# EAGLE schematic DuetReference (EAGLE 9.2.0)
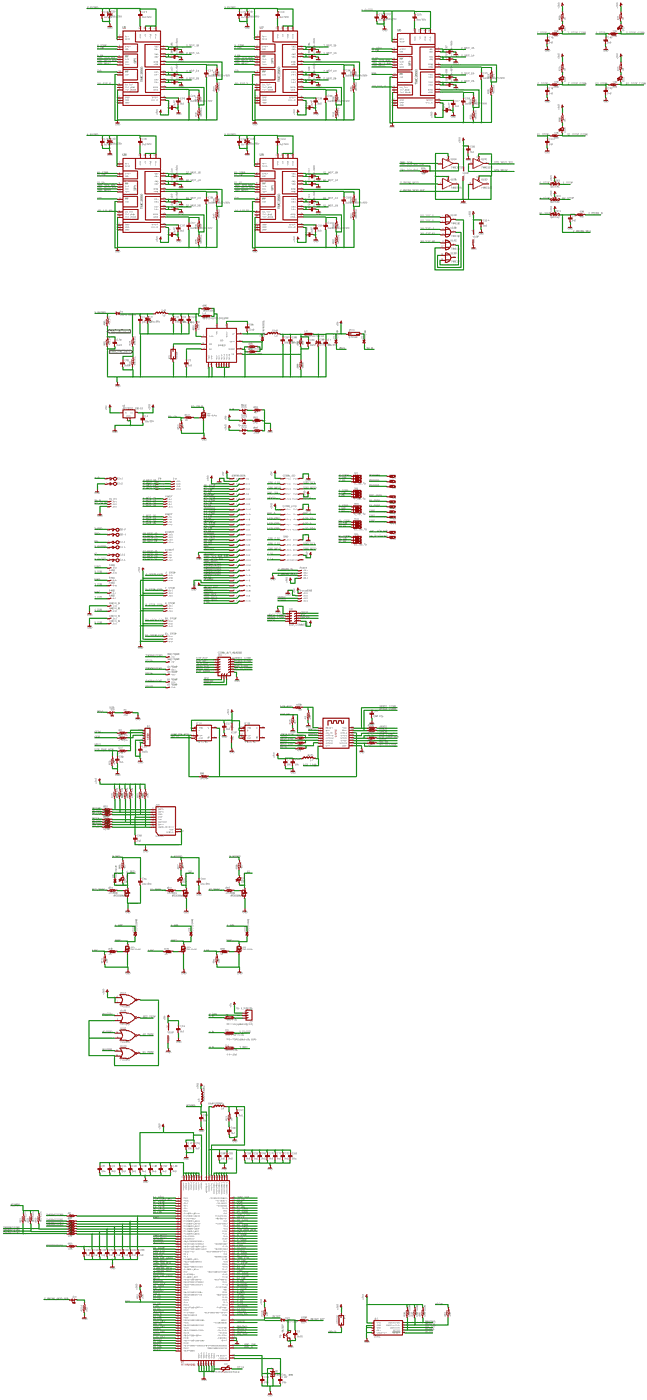
[diagram p0: schematic, sheet 1, overview]
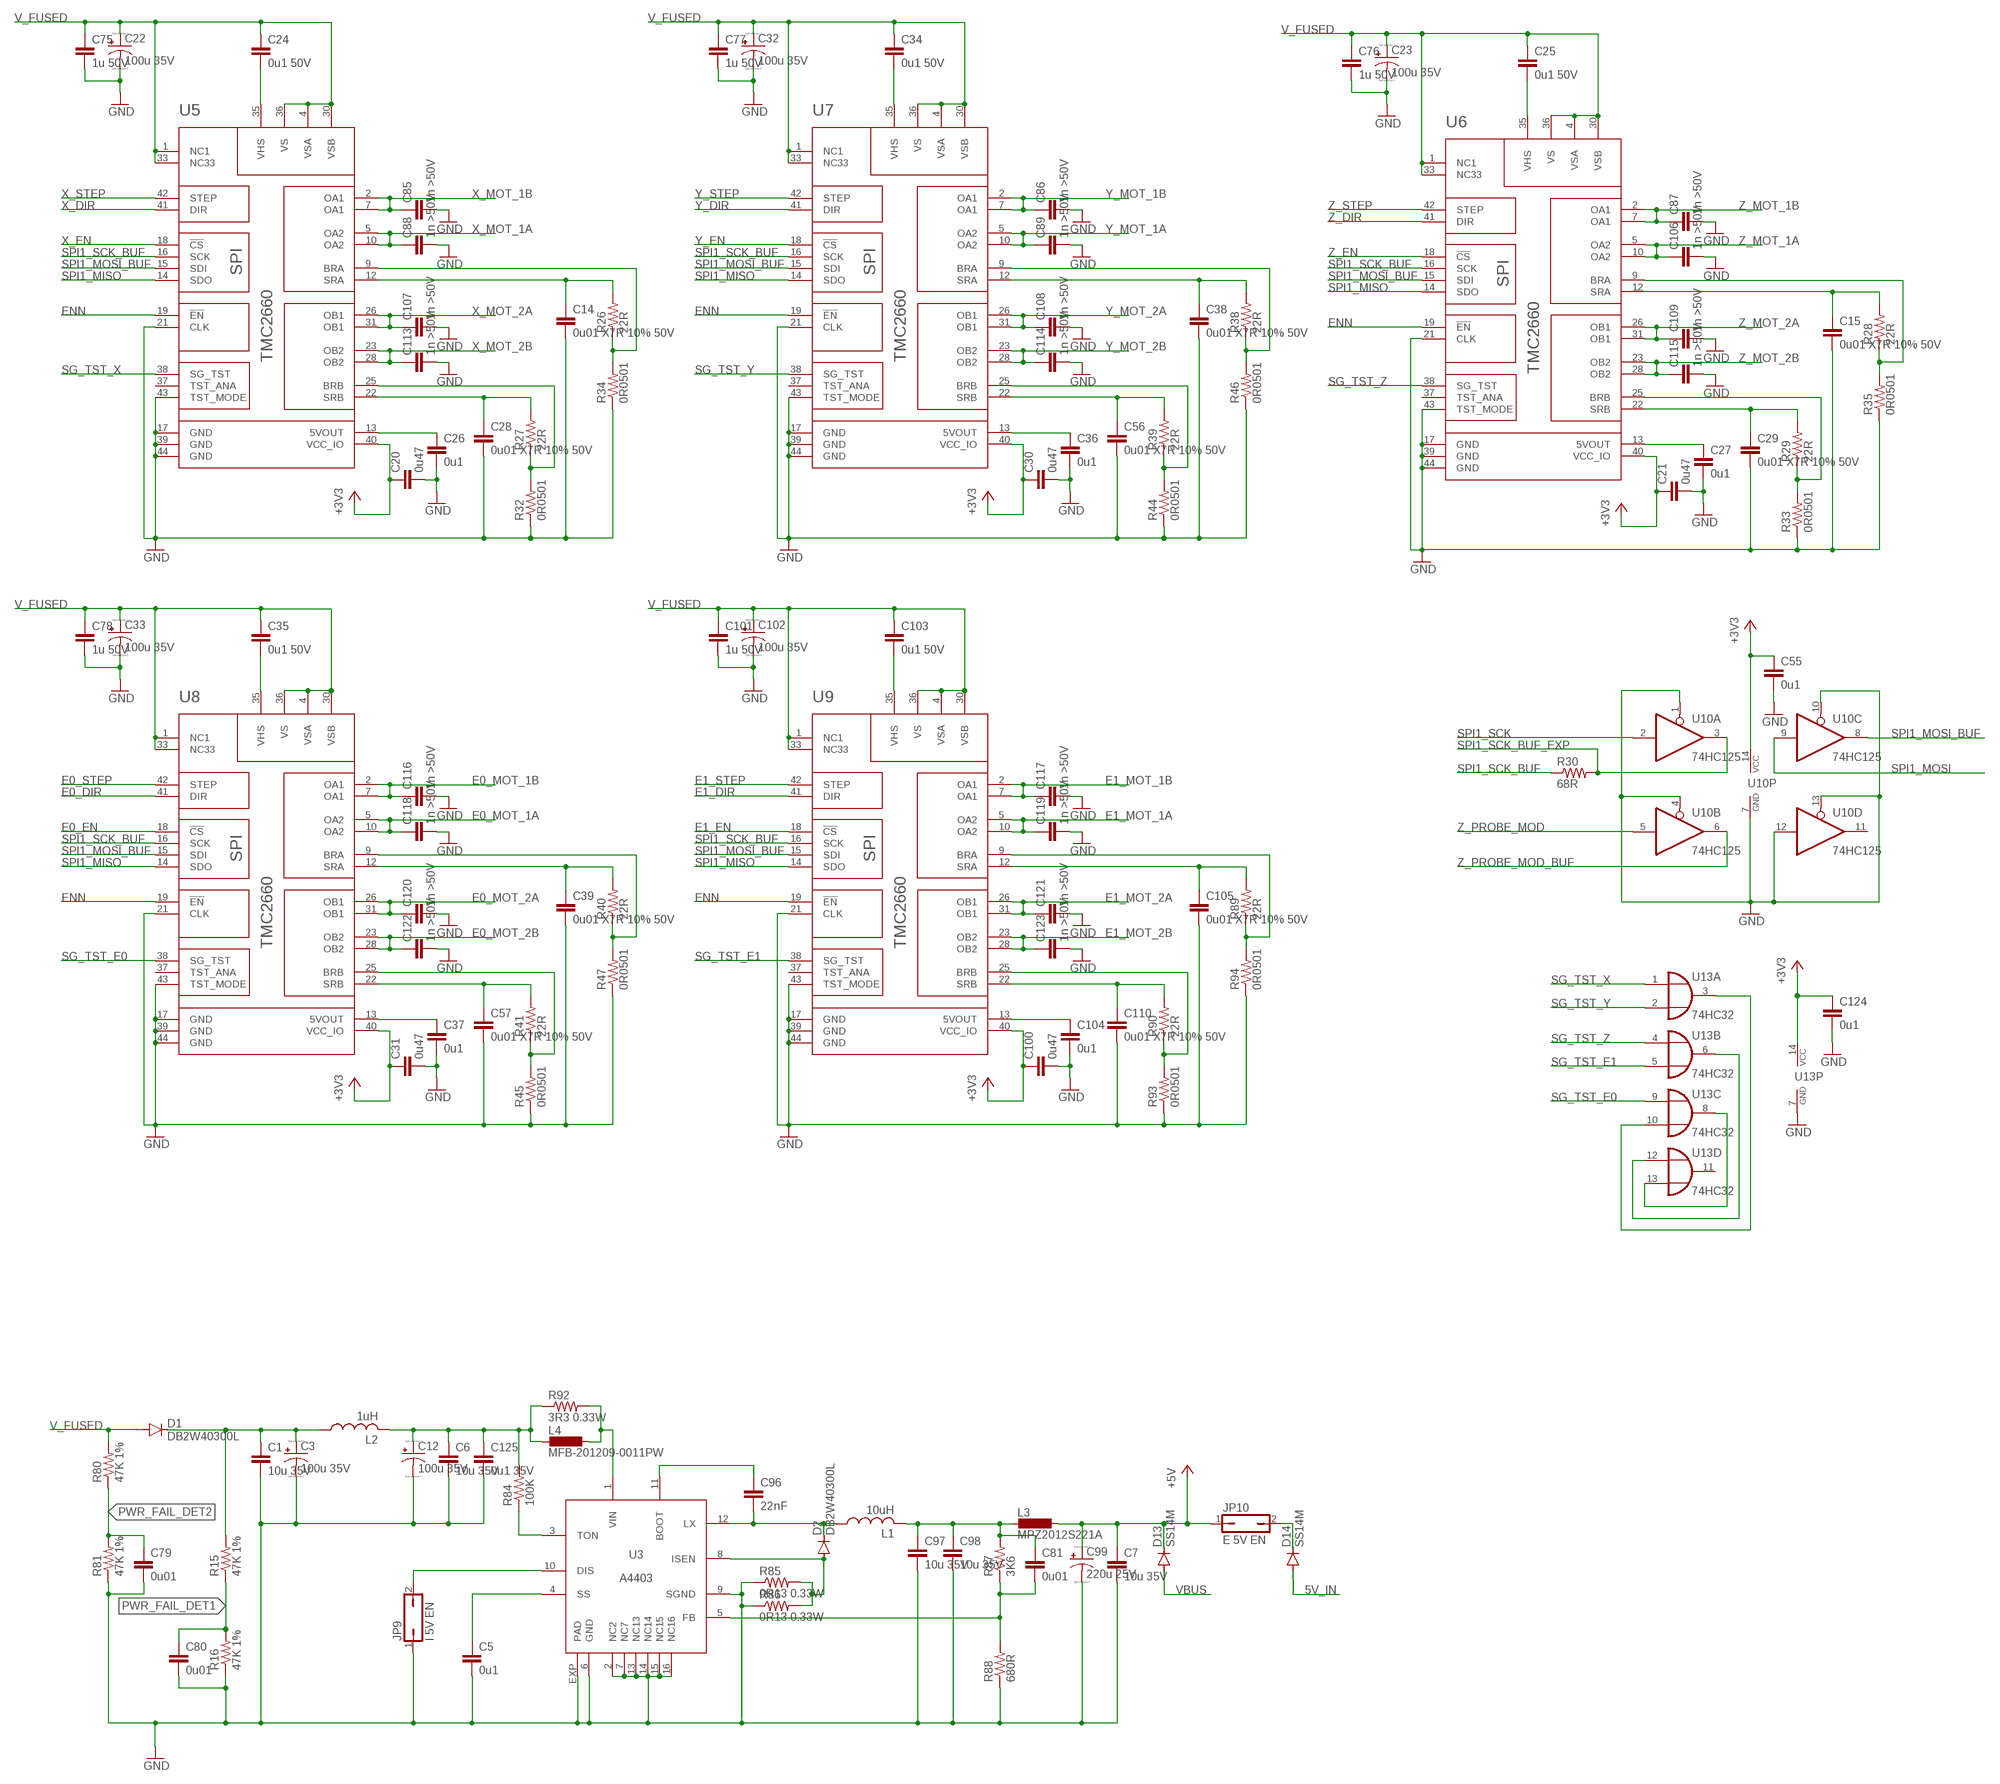
[diagram p1: schematic, sheet 1, part 1 of 5]
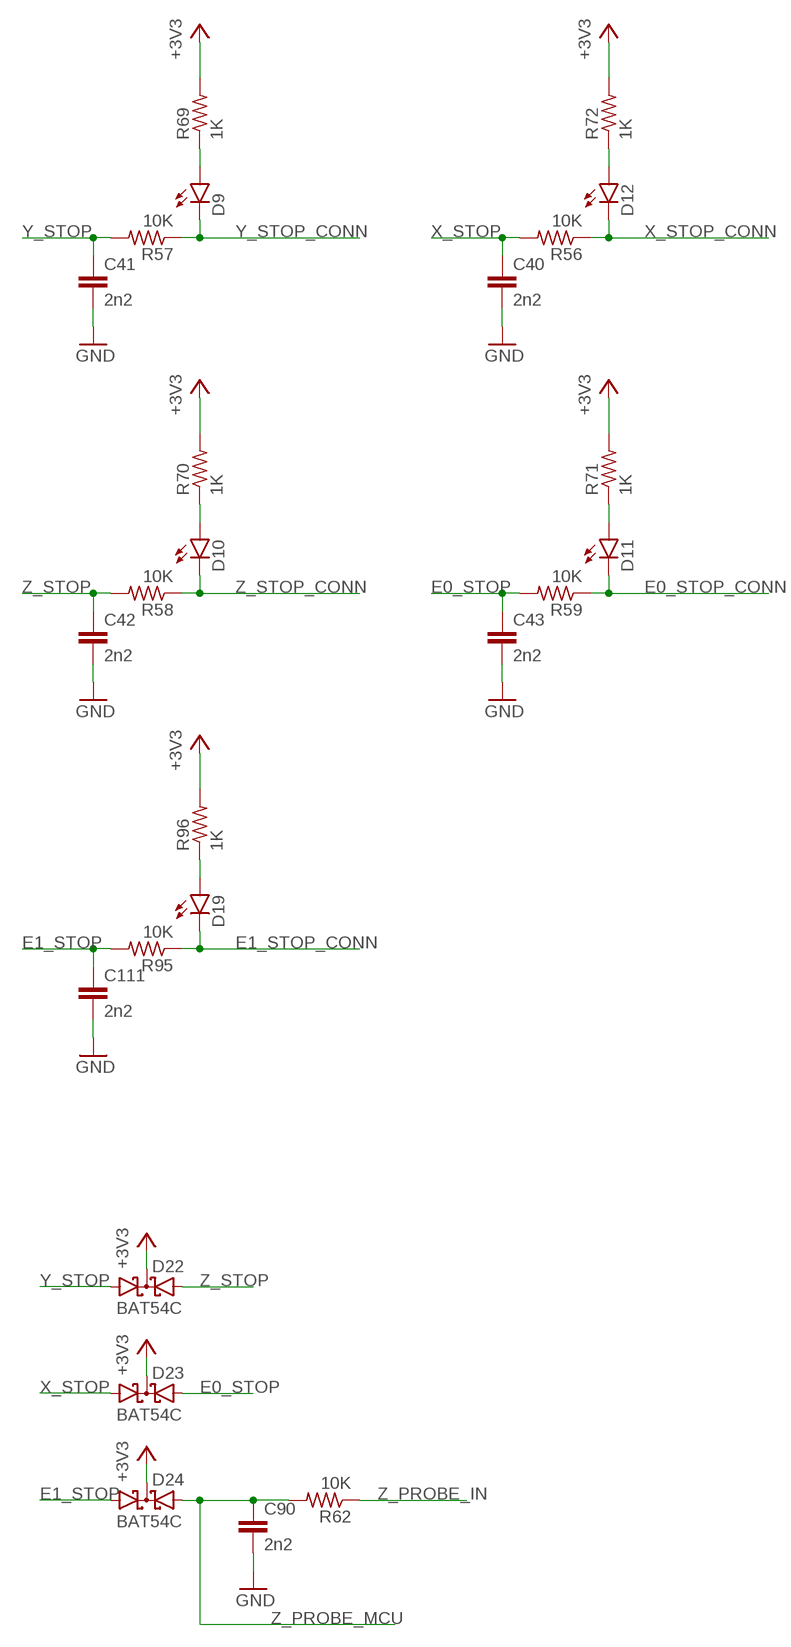
[diagram p2: schematic, sheet 1, part 2 of 5]
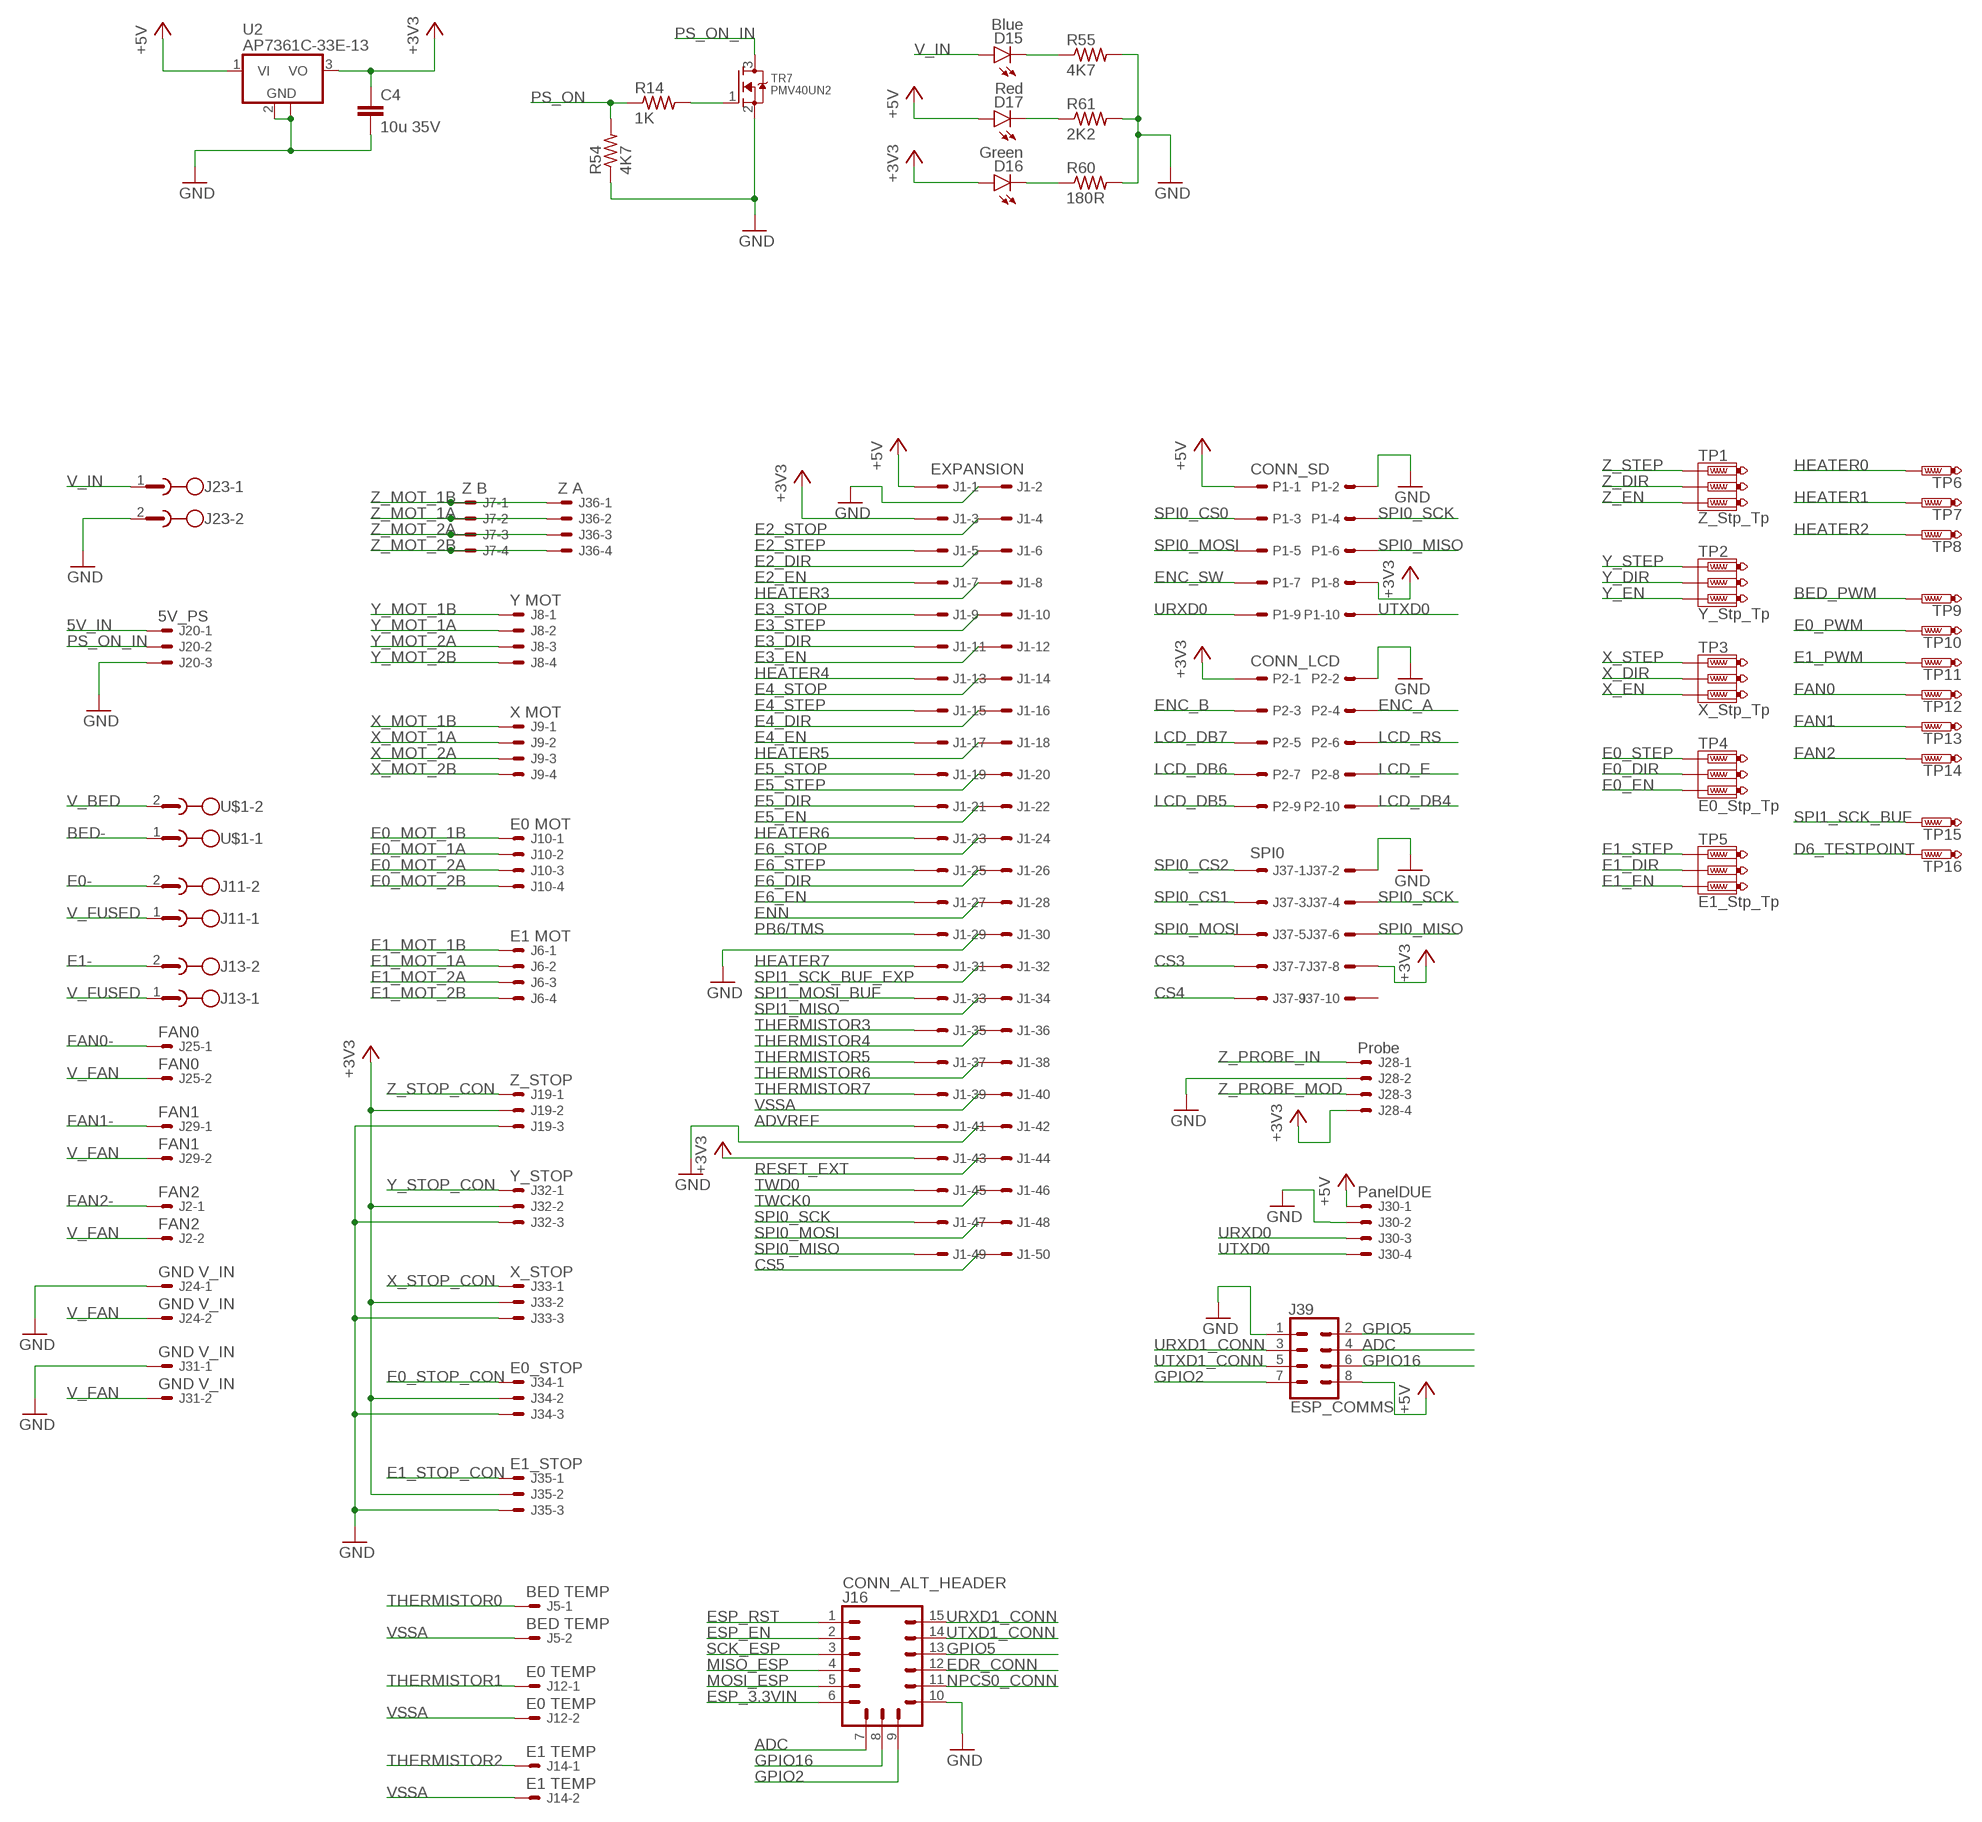
[diagram p3: schematic, sheet 1, part 3 of 5]
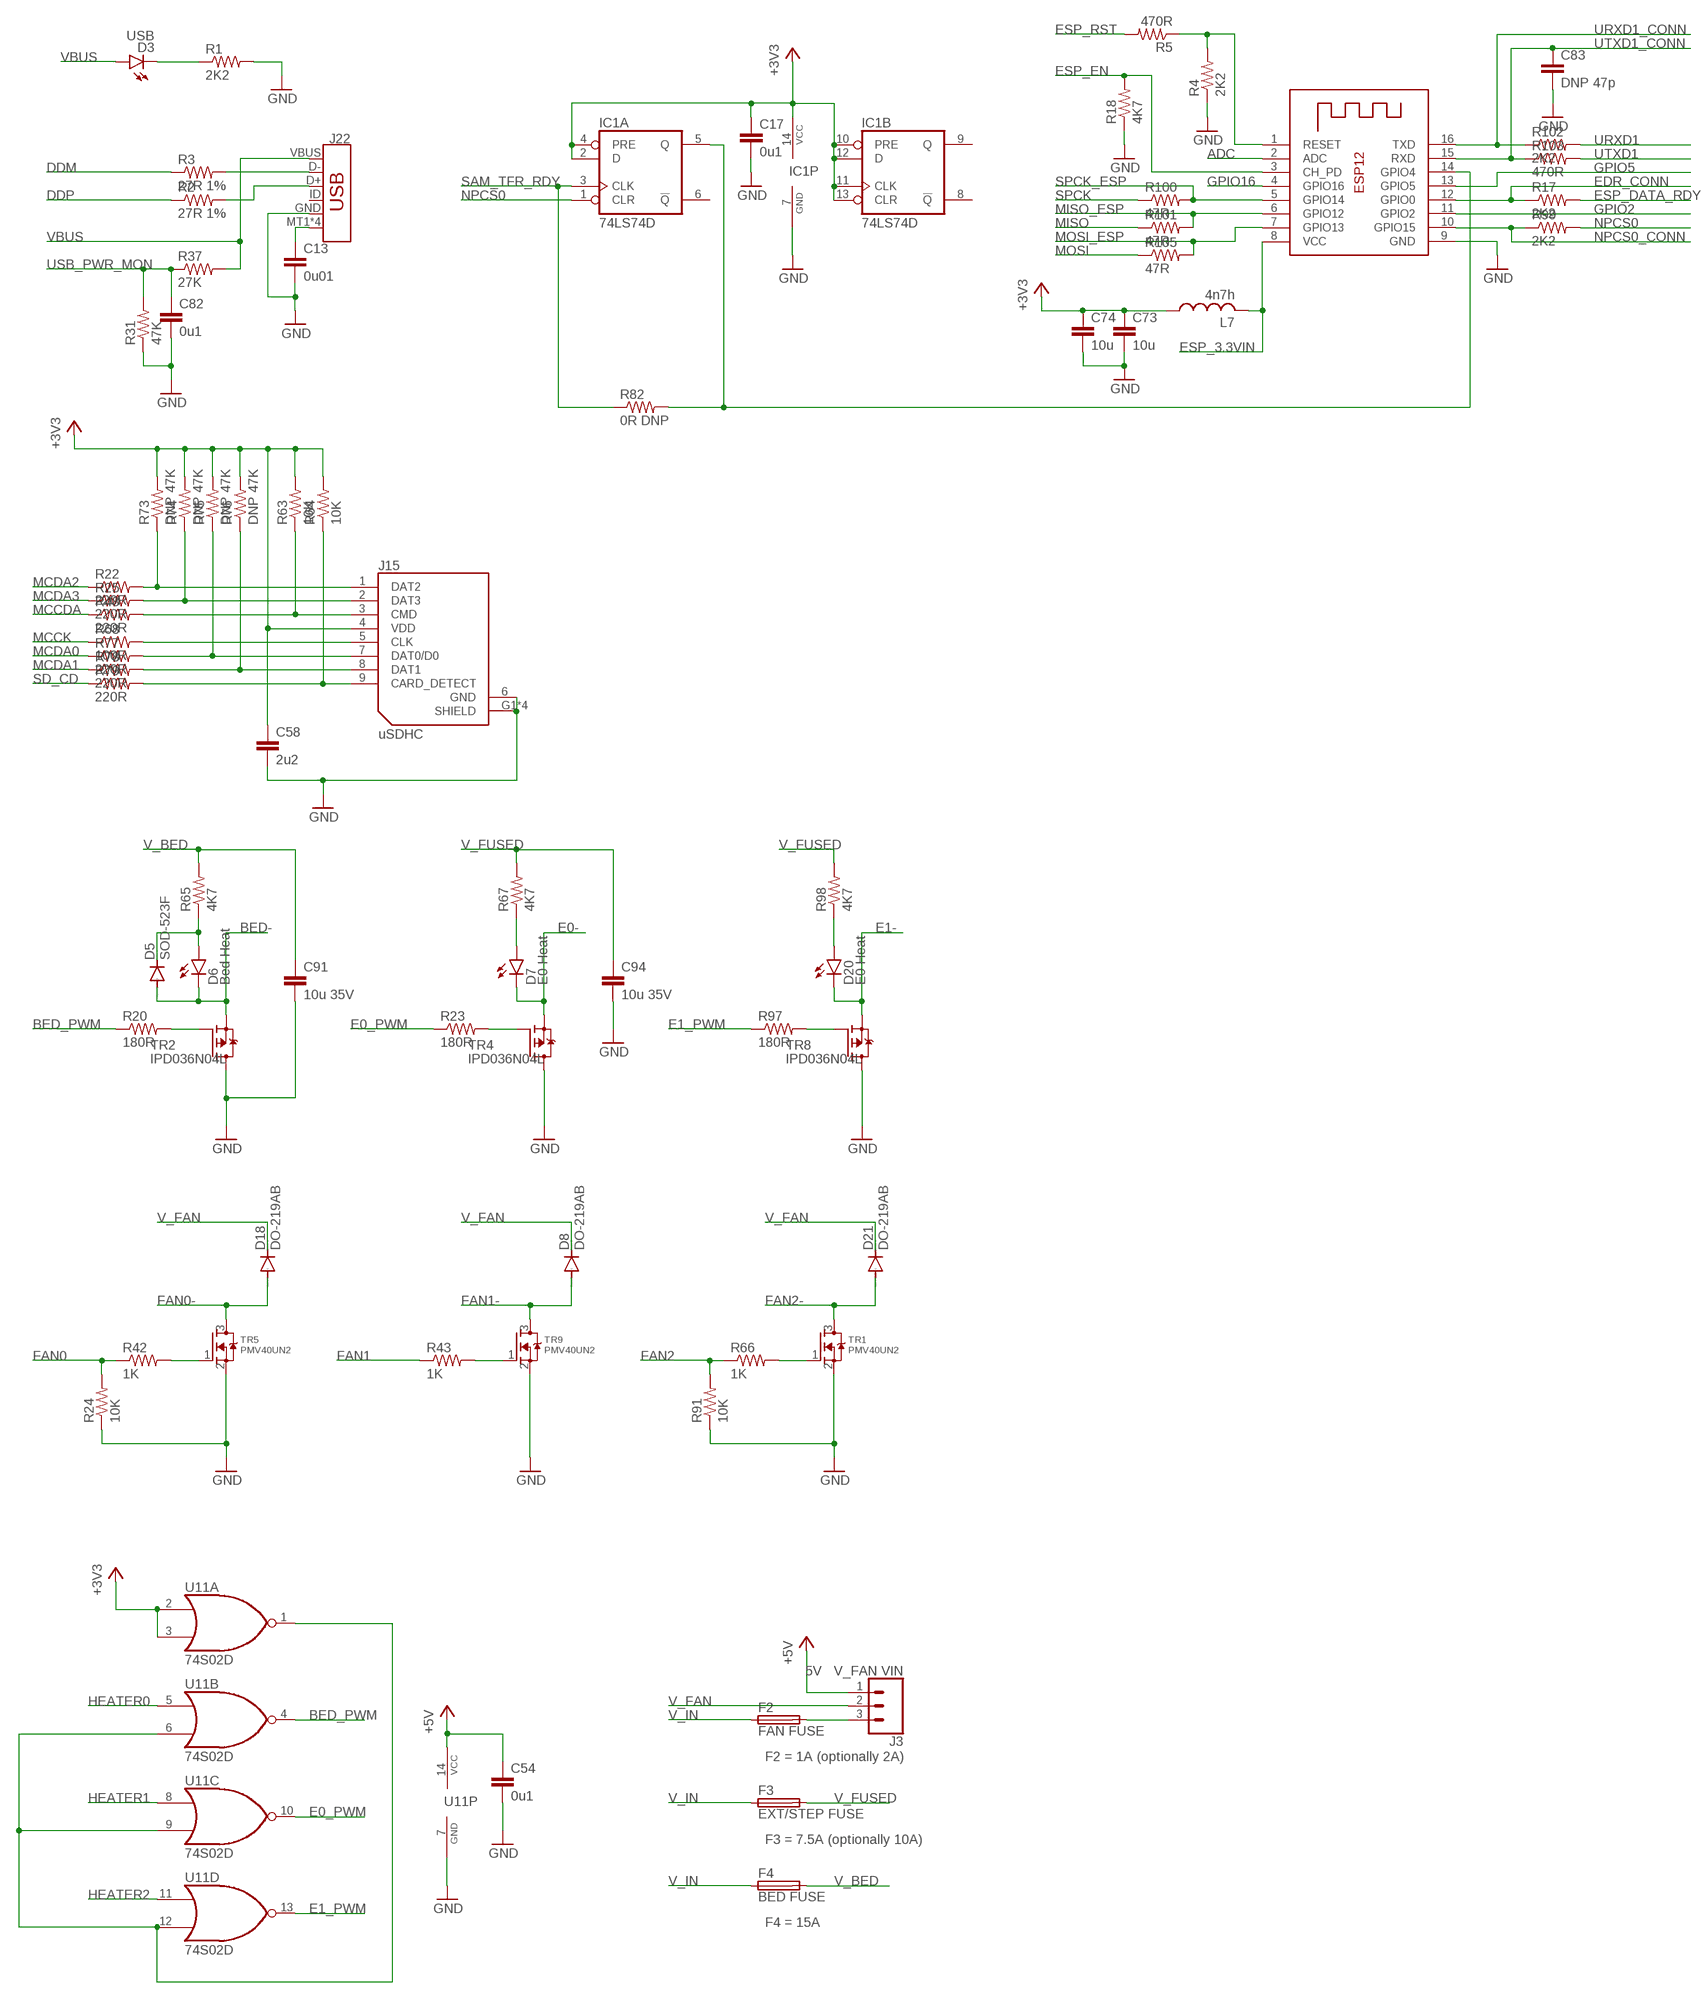
[diagram p4: schematic, sheet 1, part 4 of 5]
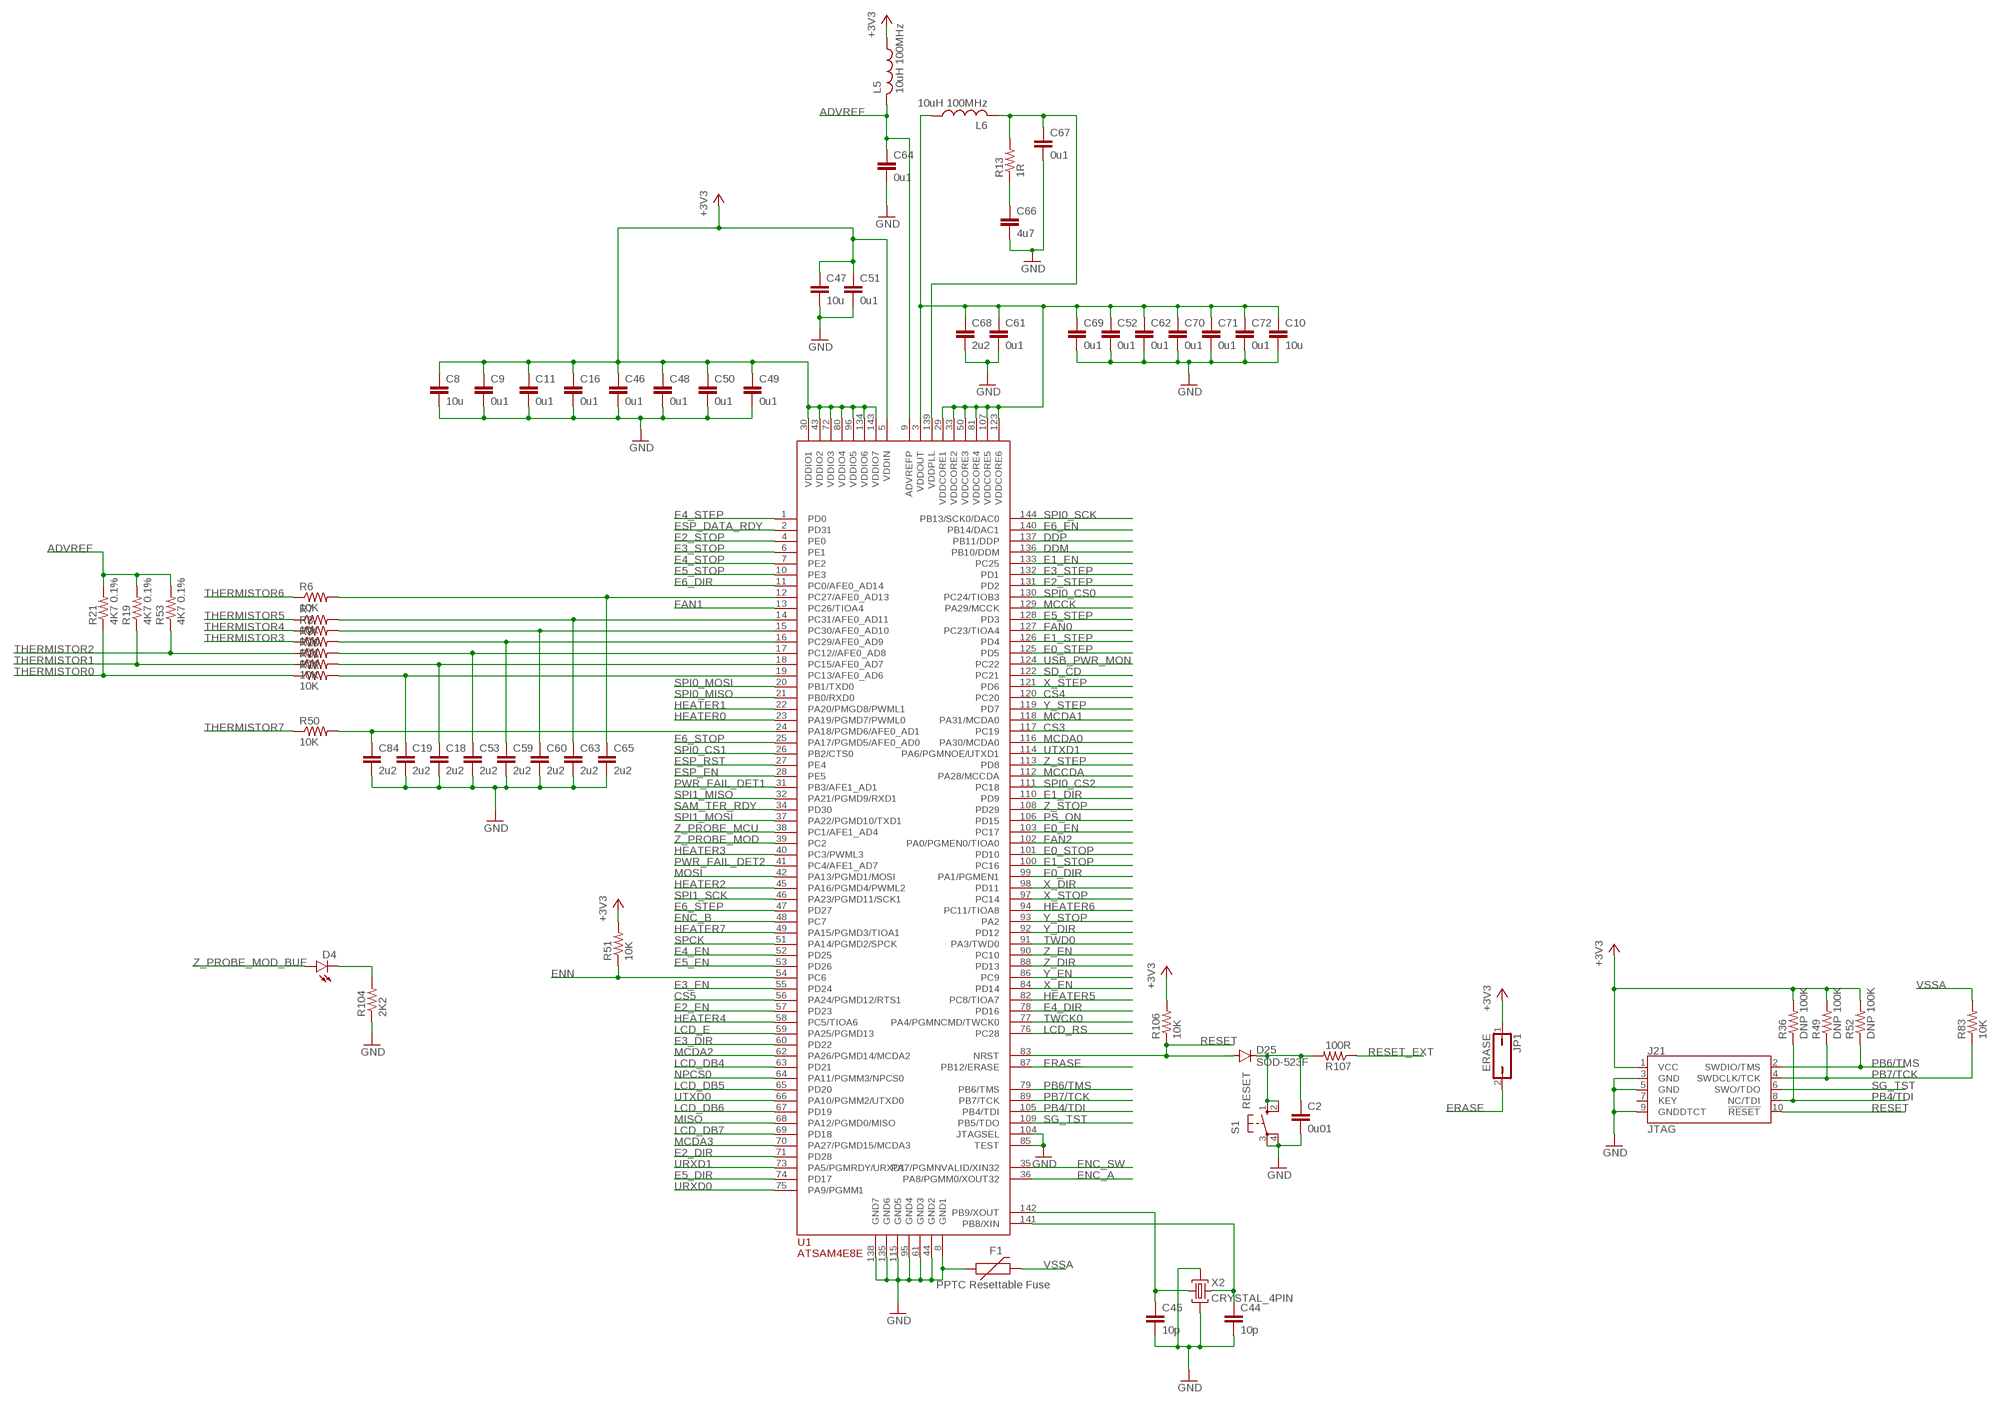
[diagram p5: schematic, sheet 1, part 5 of 5]

## Parts
C1  10u 35V  C-EUC0805  [C0805]
C2  0u01  C-EUC0805  [C0805]
C3  100u 35V  CPOL-USD  [PANASONIC_D]
C4  10u 35V  C-EUC0805  [C0805]
C5  0u1  C-EUC0805  [C0805]
C6  10u 35V  C-EUC0805  [C0805]
C7  10u 35V  C-EUC0805  [C0805]
C8  10u  C-EUC0805  [C0805]
C9  0u1  C-EUC0805  [C0805]
C10  10u  C-EUC0805  [C0805]
C11  0u1  C-EUC0805  [C0805]
C12  100u 35V  CPOL-USD  [PANASONIC_D]
C13  0u01  C-EUC0805  [C0805]
C14  0u01 X7R 10% 50V  C-EUC0805  [C0805]
C15  0u01 X7R 10% 50V  C-EUC0805  [C0805]
C16  0u1  C-EUC0805  [C0805]
C17  0u1  C-EUC0805  [C0805]
C18  2u2  C-EUC0805  [C0805]
C19  2u2  C-EUC0805  [C0805]
C20  0u47  C-EUC0805  [C0805]
C21  0u47  C-EUC0805  [C0805]
C22  100u 35V  CPOL-USD  [PANASONIC_D]
C23  100u 35V  CPOL-USD  [PANASONIC_D]
C24  0u1 50V  C-EUC0805  [C0805]
C25  0u1 50V  C-EUC0805  [C0805]
C26  0u1  C-EUC0805  [C0805]
C27  0u1  C-EUC0805  [C0805]
C28  0u01 X7R 10% 50V  C-EUC0805  [C0805]
C29  0u01 X7R 10% 50V  C-EUC0805  [C0805]
C30  0u47  C-EUC0805  [C0805]
C31  0u47  C-EUC0805  [C0805]
C32  100u 35V  CPOL-USD  [PANASONIC_D]
C33  100u 35V  CPOL-USD  [PANASONIC_D]
C34  0u1 50V  C-EUC0805  [C0805]
C35  0u1 50V  C-EUC0805  [C0805]
C36  0u1  C-EUC0805  [C0805]
C37  0u1  C-EUC0805  [C0805]
C38  0u01 X7R 10% 50V  C-EUC0805  [C0805]
C39  0u01 X7R 10% 50V  C-EUC0805  [C0805]
C40  2n2  C-EUC0805  [C0805]
C41  2n2  C-EUC0805  [C0805]
C42  2n2  C-EUC0805  [C0805]
C43  2n2  C-EUC0805  [C0805]
C44  10p  C-EUC0805  [C0805]
C45  10p  C-EUC0805  [C0805]
C46  0u1  C-EUC0805  [C0805]
C47  10u  C-EUC0805  [C0805]
C48  0u1  C-EUC0805  [C0805]
C49  0u1  C-EUC0805  [C0805]
C50  0u1  C-EUC0805  [C0805]
C51  0u1  C-EUC0805  [C0805]
C52  0u1  C-EUC0805  [C0805]
C53  2u2  C-EUC0805  [C0805]
C54  0u1  C-EUC0805  [C0805]
C55  0u1  C-EUC0805  [C0805]
C56  0u01 X7R 10% 50V  C-EUC0805  [C0805]
C57  0u01 X7R 10% 50V  C-EUC0805  [C0805]
C58  2u2  C-EUC0805  [C0805]
C59  2u2  C-EUC0805  [C0805]
C60  2u2  C-EUC0805  [C0805]
C61  0u1  C-EUC0805  [C0805]
C62  0u1  C-EUC0805  [C0805]
C63  2u2  C-EUC0805  [C0805]
C64  0u1  C-EUC0805  [C0805]
C65  2u2  C-EUC0805  [C0805]
C66  4u7  C-EUC0805  [C0805]
C67  0u1  C-EUC0805  [C0805]
C68  2u2  C-EUC0805  [C0805]
C69  0u1  C-EUC0805  [C0805]
C70  0u1  C-EUC0805  [C0805]
C71  0u1  C-EUC0805  [C0805]
C72  0u1  C-EUC0805  [C0805]
C73  10u  C-EUC0805  [C0805]
C74  10u  C-EUC0805  [C0805]
C75  1u 50V  C-EUC0805  [C0805]
C76  1u 50V  C-EUC0805  [C0805]
C77  1u 50V  C-EUC0805  [C0805]
C78  1u 50V  C-EUC0805  [C0805]
C79  0u01  C-EUC0805  [C0805]
C80  0u01  C-EUC0805  [C0805]
C81  0u01  C-EUC0805  [C0805]
C82  0u1  C-EUC0805  [C0805]
C83  DNP 47p  C-EUC0805  [C0805]
C84  2u2  C-EUC0805  [C0805]
C85  1n >50V  C-EUC0805  [C0805]
C86  1n >50V  C-EUC0805  [C0805]
C87  1n >50V  C-EUC0805  [C0805]
C88  1n >50V  C-EUC0805  [C0805]
C89  1n >50V  C-EUC0805  [C0805]
C90  2n2  C-EUC0805  [C0805]
C91  10u 35V  C-EUC0805  [C0805]
C94  10u 35V  C-EUC0805  [C0805]
C96  22nF  C-EUC0805  [C0805]
C97  10u 35V  C-EUC0805  [C0805]
C98  10u 35V  C-EUC0805  [C0805]
C99  220u 25V  CPOL-USD  [PANASONIC_D]
C100  0u47  C-EUC0805  [C0805]
C101  1u 50V  C-EUC0805  [C0805]
C102  100u 35V  CPOL-USD  [PANASONIC_D]
C103  0u1 50V  C-EUC0805  [C0805]
C104  0u1  C-EUC0805  [C0805]
C105  0u01 X7R 10% 50V  C-EUC0805  [C0805]
C106  1n >50V  C-EUC0805  [C0805]
C107  1n >50V  C-EUC0805  [C0805]
C108  1n >50V  C-EUC0805  [C0805]
C109  1n >50V  C-EUC0805  [C0805]
C110  0u01 X7R 10% 50V  C-EUC0805  [C0805]
C111  2n2  C-EUC0805  [C0805]
C113  1n >50V  C-EUC0805  [C0805]
C114  1n >50V  C-EUC0805  [C0805]
C115  1n >50V  C-EUC0805  [C0805]
C116  1n >50V  C-EUC0805  [C0805]
C117  1n >50V  C-EUC0805  [C0805]
C118  1n >50V  C-EUC0805  [C0805]
C119  1n >50V  C-EUC0805  [C0805]
C120  1n >50V  C-EUC0805  [C0805]
C121  1n >50V  C-EUC0805  [C0805]
C122  1n >50V  C-EUC0805  [C0805]
C123  1n >50V  C-EUC0805  [C0805]
C124  0u1  C-EUC0805  [C0805]
C125  0u1 35V  C-EUC0805  [C0805]
D1  DB2W40300L  DIODE-SOD123  [SOD123]
D2  DB2W40300L  DIODE-SOD123  [SOD123]
D3  USB  LEDCHIPLED_0805  [CHIPLED_0805]
D4  LEDCHIPLED_0805  [CHIPLED_0805]
D5  SOD-523F  DIODE-SOD523  [SOD523]
D6  Bed Heat  LEDCHIPLED_0805  [CHIPLED_0805]
D7  E0 Heat  LEDCHIPLED_0805  [CHIPLED_0805]
D8  DO-219AB  DIODE-SOD123  [SOD123]
D9  LEDCHIPLED_0805  [CHIPLED_0805]
D10  LEDCHIPLED_0805  [CHIPLED_0805]
D11  LEDCHIPLED_0805  [CHIPLED_0805]
D12  LEDCHIPLED_0805  [CHIPLED_0805]
D13  SS14M  S1M  [SMA]
D14  SS14M  S1M  [SMA]
D15  Blue  LEDCHIPLED_0805  [CHIPLED_0805]
D16  Green  LEDCHIPLED_0805  [CHIPLED_0805]
D17  Red  LEDCHIPLED_0805  [CHIPLED_0805]
D18  DO-219AB  DIODE-SOD123  [SOD123]
D19  LEDCHIPLED_0805  [CHIPLED_0805]
D20  E0 Heat  LEDCHIPLED_0805  [CHIPLED_0805]
D21  DO-219AB  DIODE-SOD123  [SOD123]
D22  BAT54C  [SOT23]
D23  BAT54C  [SOT23]
D24  BAT54C  [SOT23]
D25  SOD-523F  DIODE-SOD523  [SOD523]
F1  PPTC Resettable Fuse  PPTC_HALF-AMP  [1206]
F2  FAN FUSE  FUSELITTLEFUSE  [LITTLEFUSE]
F3  EXT/STEP FUSE  FUSELITTLEFUSE  [LITTLEFUSE]
F4  BED FUSE  FUSELITTLEFUSE  [LITTLEFUSE]
IC1  74LS74D  [SO14]
J1  EXPANSION  057-050-1  [057-050-1]
J2  FAN2  KK-156-2  [KK-156-2]
J3  5V V_FAN VIN  CONN_03  [1X03]
J5  BED TEMP  KK-156-2  [KK-156-2]
J6  E1 MOT  KK-156-4  [KK-156-4]
J7  Z B  KK-156-4  [KK-156-4]
J8  Y MOT  KK-156-4  [KK-156-4]
J9  X MOT  KK-156-4  [KK-156-4]
J10  E0 MOT  KK-156-4  [KK-156-4]
J11  E0 HEAT  2-PIN-350  [2-PIN-350]
J12  E0 TEMP  KK-156-2  [KK-156-2]
J13  2-PIN-350  [2-PIN-350]
J14  E1 TEMP  KK-156-2  [KK-156-2]
J15  uSDHC  USDHC  [USDHC]
J16  CONN_ALT_HEADER  [CONN_ALT_HEADER]
J19  Z_STOP  KK-156-3  [KK-156-3]
J20  5V_PS  KK-156-3  [KK-156-3]
J21  JTAG  CORTEX_DEBUG_PTH  [2X5-PTH-1.27MM]
J22  USB_MICRO-B_SMT  [USB-MICROB]
J23  VIN  2-PIN-635  [2-PIN-635]
J24  GND V_IN  KK-156-2  [KK-156-2]
J25  FAN0  KK-156-2  [KK-156-2]
J28  Probe  KK-156-4  [KK-156-4]
J29  FAN1  KK-156-2  [KK-156-2]
J30  PanelDUE  KK-156-4  [KK-156-4]
J31  GND V_IN  KK-156-2  [KK-156-2]
J32  Y_STOP  KK-156-3  [KK-156-3]
J33  X_STOP  KK-156-3  [KK-156-3]
J34  E0_STOP  KK-156-3  [KK-156-3]
J35  E1_STOP  KK-156-3  [KK-156-3]
J36  Z A  KK-156-4  [KK-156-4]
J37  SPI0  057-010-1  [057-010-1]
J39  ESP_COMMS  CONN_04X2  [2X4]
JP1  ERASE  JP1Q  [JP1]
JP9  I 5V EN  JP1Q  [JP1]
JP10  E 5V EN  JP1Q  [JP1]
L1  10uH  L-USL1812  [L1812]
L2  1uH  L-USL1812  [L1812]
L3  MPZ2012S221A  L-EUL2012C  [L2012C]
L4  MFB-201209-0011PW  L-EUL2012C  [L2012C]
L5  10uH 100MHz  L-USL1812  [L1812]
L6  10uH 100MHz  L-USL1812  [L1812]
L7  4n7h  L-USL1812  [L1812]
P1  CONN_SD  057-010-1  [057-010-1]
P2  CONN_LCD  057-010-1  [057-010-1]
R1  2K2  R-US_R0805  [R0805]
R2  27R 1%  R-US_R0805  [R0805]
R3  27R 1%  R-US_R0805  [R0805]
R4  2K2  R-US_R0805  [R0805]
R5  470R  R-US_R0805  [R0805]
R6  10K  R-US_R0805  [R0805]
R7  10K  R-US_R0805  [R0805]
R8  10K  R-US_R0805  [R0805]
R9  10K  R-US_R0805  [R0805]
R10  10K  R-US_R0805  [R0805]
R11  10K  R-US_R0805  [R0805]
R12  10K  R-US_R0805  [R0805]
R13  1R  R-US_R0805  [R0805]
R14  1K  R-US_R0805  [R0805]
R15  47K 1%  R-US_R0805  [R0805]
R16  47K 1%  R-US_R0805  [R0805]
R17  2K2  R-US_R0805  [R0805]
R18  4K7  R-US_R0805  [R0805]
R19  4K7 0.1%  R-US_R0805  [R0805]
R20  180R  R-US_R0805  [R0805]
R21  4K7 0.1%  R-US_R0805  [R0805]
R22  220R  R-US_R0805  [R0805]
R23  180R  R-US_R0805  [R0805]
R24  10K  R-US_R0805  [R0805]
R25  220R  R-US_R0805  [R0805]
R26  22R  R-US_R0805  [R0805]
R27  22R  R-US_R0805  [R0805]
R28  22R  R-US_R0805  [R0805]
R29  22R  R-US_R0805  [R0805]
R30  68R  R-US_R0805  [R0805]
R31  47K  R-US_R0805  [R0805]
R32  0R0501  R-US_R0805  [R0805]
R33  0R0501  R-US_R0805  [R0805]
R34  0R0501  R-US_R0805  [R0805]
R35  0R0501  R-US_R0805  [R0805]
R36  DNP 100K  R-US_R0805  [R0805]
R37  27K  R-US_R0805  [R0805]
R38  22R  R-US_R0805  [R0805]
R39  22R  R-US_R0805  [R0805]
R40  22R  R-US_R0805  [R0805]
R41  22R  R-US_R0805  [R0805]
R42  1K  R-US_R0805  [R0805]
R43  1K  R-US_R0805  [R0805]
R44  0R0501  R-US_R0805  [R0805]
R45  0R0501  R-US_R0805  [R0805]
R46  0R0501  R-US_R0805  [R0805]
R47  0R0501  R-US_R0805  [R0805]
R48  220R  R-US_R0805  [R0805]
R49  DNP 100K  R-US_R0805  [R0805]
R50  10K  R-US_R0805  [R0805]
R51  10K  R-US_R0805  [R0805]
R52  DNP 100K  R-US_R0805  [R0805]
R53  4K7 0.1%  R-US_R0805  [R0805]
R54  4K7  R-US_R0805  [R0805]
R55  4K7  R-US_R0805  [R0805]
R56  10K  R-US_R0805  [R0805]
R57  10K  R-US_R0805  [R0805]
R58  10K  R-US_R0805  [R0805]
R59  10K  R-US_R0805  [R0805]
R60  180R  R-US_R0805  [R0805]
R61  2K2  R-US_R0805  [R0805]
R62  10K  R-US_R0805  [R0805]
R63  10K  R-US_R0805  [R0805]
R64  10K  R-US_R0805  [R0805]
R65  4K7  R-US_R0805  [R0805]
R66  1K  R-US_R0805  [R0805]
R67  4K7  R-US_R0805  [R0805]
R68  100R  R-US_R0805  [R0805]
R69  1K  R-US_R0805  [R0805]
R70  1K  R-US_R0805  [R0805]
R71  1K  R-US_R0805  [R0805]
R72  1K  R-US_R0805  [R0805]
R73  DNP 47K  R-US_R0805  [R0805]
R74  DNP 47K  R-US_R0805  [R0805]
R75  DNP 47K  R-US_R0805  [R0805]
R76  DNP 47K  R-US_R0805  [R0805]
R77  220R  R-US_R0805  [R0805]
R78  220R  R-US_R0805  [R0805]
R79  220R  R-US_R0805  [R0805]
R80  47K 1%  R-US_R0805  [R0805]
R81  47K 1%  R-US_R0805  [R0805]
R82  0R DNP  R-US_R0805  [R0805]
R83  10K  R-US_R0805  [R0805]
R84  100K  R-US_R0805  [R0805]
R85  0R13 0.33W  R-US_R0805  [R0805]
R86  0R13 0.33W  R-US_R0805  [R0805]
R87  3K6  R-US_R0805  [R0805]
R88  680R  R-US_R0805  [R0805]
R89  22R  R-US_R0805  [R0805]
R90  22R  R-US_R0805  [R0805]
R91  10K  R-US_R0805  [R0805]
R92  3R3 0.33W  R-US_R0805  [R0805]
R93  0R0501  R-US_R0805  [R0805]
R94  0R0501  R-US_R0805  [R0805]
R95  10K  R-US_R0805  [R0805]
R96  1K  R-US_R0805  [R0805]
R97  180R  R-US_R0805  [R0805]
R98  4K7  R-US_R0805  [R0805]
R99  2K2  R-US_R0805  [R0805]
R100  47R  R-US_R0805  [R0805]
R101  47R  R-US_R0805  [R0805]
R102  2K2  R-US_R0805  [R0805]
R103  470R  R-US_R0805  [R0805]
R104  2K2  R-US_R0805  [R0805]
R105  47R  R-US_R0805  [R0805]
R106  10K  R-US_R0805  [R0805]
R107  100R  R-US_R0805  [R0805]
S1  RESET  10-XX  [B3F-10XX]
TP1  Z_Stp_Tp  TP-3PIN  [TP-3-PIN]
TP2  Y_Stp_Tp  TP-3PIN  [TP-3-PIN]
TP3  X_Stp_Tp  TP-3PIN  [TP-3-PIN]
TP4  E0_Stp_Tp  TP-3PIN  [TP-3-PIN]
TP5  E1_Stp_Tp  TP-3PIN  [TP-3-PIN]
TP6  TP-VIA  [TP-VIA]
TP7  TP-VIA  [TP-VIA]
TP8  TP-VIA  [TP-VIA]
TP9  TP-VIA  [TP-VIA]
TP10  TP-VIA  [TP-VIA]
TP11  TP-VIA  [TP-VIA]
TP12  TP-VIA  [TP-VIA]
TP13  TP-VIA  [TP-VIA]
TP14  TP-VIA  [TP-VIA]
TP15  TP-VIA  [TP-VIA]
TP16  TP-VIA  [TP-VIA]
TR1  PMV40UN2  MOSFET-NREFLOW  [SOT23]
TR2  IPD036N04L  SPD30P06PTO252  [TO252]
TR4  IPD036N04L  SPD30P06PTO252  [TO252]
TR5  PMV40UN2  MOSFET-NREFLOW  [SOT23]
TR7  PMV40UN2  MOSFET-NREFLOW  [SOT23]
TR8  IPD036N04L  SPD30P06PTO252  [TO252]
TR9  PMV40UN2  MOSFET-NREFLOW  [SOT23]
U1  ATSAM4E8E  [LQFP144]
U2  AP7361C-33E-13  UA78M33DCY  [SOT223]
U3  A4403  [QFN16-4X4]
U4  ESP-12  [ESP-12]
U5  TMC2660  [TMC2660]
U6  TMC2660  [TMC2660]
U7  TMC2660  [TMC2660]
U8  TMC2660  [TMC2660]
U9  TMC2660  [TMC2660]
U10  74HC125  74AC125D  [SO14]
U11  74S02D  [SO14]
U13  74HC32  74HC32D  [SO14]
U$1  BED HEAT  2-PIN-635  [2-PIN-635]
X2  CRYSTAL_4PIN  CRYSTAL-3.2-2.5  [CRYSTAL-3.2-2.5]

## Nets
5V_IN: D14.A J20.1
+3V3: C4.1 C8.1 C9.1 C11.1 C16.1 C17.1 C20.1 C21.1 C30.1 C31.1 C46.1 C47.1 C48.1 C49.1 C50.1 C51.1 C55.1 C58.1 C73.1 C74.1 C100.1 C124.1 D16.A D22.3(CC) D23.3(CC) D24.3(CC) IC1.2(A:D) IC1.4(A:PRE) IC1.10(B:PRE) IC1.11(B:CLK) IC1.12(B:D) IC1.13(B:CLR) IC1.14(P:VCC) J1.3 J1.43 J15.4(VDD) J19.2 J21.1(VCC) J28.4 J32.2 J33.2 J34.2 J35.2 J37.8 JP1.1 L5.1 L7.1 P1.8 P2.1 R36.2 R49.2 R51.2 R52.2 R63.2 R64.2 R69.2 R70.2 R71.2 R72.2 R73.2 R74.2 R75.2 R76.2 R96.2 R106.2 U1.5(VDDIN) U1.30(VDDIO1) U1.43(VDDIO2) U1.72(VDDIO3) U1.80(VDDIO4) U1.96(VDDIO5) U1.134(VDDIO6) U1.143(VDDIO7) U2.3(VO) U5.40(VCC_IO) U6.40(VCC_IO) U7.40(VCC_IO) U8.40(VCC_IO) U9.40(VCC_IO) U10.14(P:VCC) U11.2(A:I0) U11.3(A:I1) U13.14(P:VCC)
+5V: C7.1 C54.1 C99.+ D13.C D17.A J1.1 J3.1 J30.1 J39.8 JP10.1 L3.1 P1.1 U2.1(VI) U11.14(P:VCC)
ADC: J16.7 J39.4 U4.2(ADC)
ADVREF: C64.1 J1.41 L5.2 R19.2 R21.2 R53.2 U1.9(ADVREFP)
BED-: D5.A D6.C TR2.2(S) U$1.1
BED_PWM: R20.1 TP9.TP U11.4(B:O)
CS3: J37.7 U1.117(PC19)
CS4: J37.9 U1.120(PC20)
CS5: J1.50 U1.56(PA24/PGMD12/RTS1)
D6_TESTPOINT: TP16.TP
DDM: R3.1 U1.136(PB10/DDM)
DDP: R2.1 U1.137(PB11/DDP)
E0-: D7.C J11.2 TR4.2(S)
E0_DIR: TP4.2(TP1) U1.99(PA1/PGMEN1) U8.41(DIR)
E0_EN: TP4.3(TP2) U1.103(PC17) U8.18(!CS)
E0_MOT_1A: C118.1 J10.2 U8.5(OA2) U8.10(OA2)
E0_MOT_1B: C116.1 J10.1 U8.2(OA1) U8.7(OA1)
E0_MOT_2A: C120.1 J10.3 U8.26(OB1) U8.31(OB1)
E0_MOT_2B: C122.1 J10.4 U8.23(OB2) U8.28(OB2)
E0_PWM: R23.1 TP10.TP U11.10(C:O)
E0_STEP: TP4.1(TP) U1.125(PD5) U8.42(STEP)
E0_STOP: C43.1 D23.2(A2) R59.2 U1.101(PD10)
E0_STOP_CON: J34.1
E0_STOP_CONN: D11.C R59.1
E1-: D20.C J13.2 TR8.2(S)
E1_DIR: TP5.2(TP1) U1.110(PD9) U9.41(DIR)
E1_EN: TP5.3(TP2) U1.133(PC25) U9.18(!CS)
E1_MOT_1A: C119.1 J6.2 U9.5(OA2) U9.10(OA2)
E1_MOT_1B: C117.1 J6.1 U9.2(OA1) U9.7(OA1)
E1_MOT_2A: C121.1 J6.3 U9.26(OB1) U9.31(OB1)
E1_MOT_2B: C123.1 J6.4 U9.23(OB2) U9.28(OB2)
E1_PWM: R97.1 TP11.TP U11.13(D:O)
E1_STEP: TP5.1(TP) U1.126(PD4) U9.42(STEP)
E1_STOP: C111.1 D24.1(A1) R95.2 U1.100(PC16)
E1_STOP_CON: J35.1
E1_STOP_CONN: D19.C R95.1
E2_DIR: J1.6 U1.71(PD28)
E2_EN: J1.7 U1.57(PD23)
E2_STEP: J1.5 U1.131(PD2)
E2_STOP: J1.4 U1.4(PE0)
E3_DIR: J1.11 U1.60(PD22)
E3_EN: J1.12 U1.55(PD24)
E3_STEP: J1.10 U1.132(PD1)
E3_STOP: J1.9 U1.6(PE1)
E4_DIR: J1.16 U1.78(PD16)
E4_EN: J1.17 U1.52(PD25)
E4_STEP: J1.15 U1.1(PD0)
E4_STOP: J1.14 U1.7(PE2)
E5_DIR: J1.21 U1.74(PD17)
E5_EN: J1.22 U1.53(PD26)
E5_STEP: J1.20 U1.128(PD3)
E5_STOP: J1.19 U1.10(PE3)
E6_DIR: J1.26 U1.11(PC0/AFE0_AD14)
E6_EN: J1.27 U1.140(PB14/DAC1)
E6_STEP: J1.25 U1.47(PD27)
E6_STOP: J1.24 U1.25(PA17/PGMD5/AFE0_AD0)
EDR_CONN: J16.12 R17.1 U4.12(GPIO0)
ENC_A: P2.4 U1.36(PA8/PGMM0/XOUT32)
ENC_B: P2.3 U1.48(PC7)
ENC_SW: P1.7 U1.35(PA7/PGMNVALID/XIN32)
ENN: J1.28 R51.1 U1.54(PC6) U5.19(!EN) U6.19(!EN) U7.19(!EN) U8.19(!EN) U9.19(!EN)
ERASE: JP1.2 U1.87(PB12/ERASE)
ESP_3.3VIN: J16.6 L7.2 U4.8(VCC)
ESP_DATA_RDY: R17.2 U1.2(PD31)
ESP_EN: J16.2 R18.2 U1.28(PE5) U4.3(CH_PD)
ESP_RST: J16.1 R5.2 U1.27(PE4)
FAN0: R24.2 R42.1 TP12.TP U1.127(PC23/TIOA4)
FAN0-: D18.A J25.1 TR5.3(D)
FAN1: R43.1 TP13.TP U1.13(PC26/TIOA4)
FAN1-: D8.A J29.1 TR9.3(D)
FAN2: R66.1 R91.2 TP14.TP U1.102(PA0/PGMEN0/TIOA0)
FAN2-: D21.A J2.1 TR1.3(D)
GND: C1.2 C2.2 C3.- C4.2 C5.2 C6.2 C7.2 C8.2 C9.2 C10.2 C11.2 C12.- C13.2 C14.2 C15.2 C16.2 C17.2 C18.2 C19.2 C20.2 C21.2 C22.- C23.- C26.2 C27.2 C28.2 C29.2 C30.2 C31.2 C32.- C33.- C36.2 C37.2 C38.2 C39.2 C40.2 C41.2 C42.2 C43.2 C44.2 C45.2 C46.2 C47.2 C48.2 C49.2 C50.2 C51.2 C52.2 C53.2 C54.2 C55.2 C56.2 C57.2 C58.2 C59.2 C60.2 C61.2 C62.2 C63.2 C64.2 C65.2 C66.2 C67.2 C68.2 C69.2 C70.2 C71.2 C72.2 C73.2 C74.2 C75.2 C76.2 C77.2 C78.2 C79.2 C80.2 C82.2 C83.2 C84.2 C85.2 C86.2 C87.2 C88.2 C89.2 C90.2 C91.2 C94.2 C97.2 C98.2 C99.- C100.2 C101.2 C102.- C104.2 C105.2 C106.2 C107.2 C108.2 C109.2 C110.2 C111.2 C113.2 C114.2 C115.2 C116.2 C117.2 C118.2 C119.2 C120.2 C121.2 C122.2 C123.2 C124.2 C125.2 F1.1 IC1.7(P:GND) J1.2 J1.30 J1.42 J15.6(GND) J15.G1(SHIELD) J15.G2(SHIELD) J15.G3(SHIELD) J15.G4(SHIELD) J16.10 J19.3 J20.3 J21.3(GND) J21.5(GND) J21.9(GNDDTCT) J22.GND J23.2 J24.1 J28.2 J30.2 J31.1 J32.3 J33.3 J34.3 J35.3 J37.2 J39.1 JP9.1 P1.2 P2.2 R1.2 R4.1 R16.1 R18.1 R24.1 R31.1 R32.1 R33.1 R34.1 R35.1 R44.1 R45.1 R46.1 R47.1 R54.1 R55.2 R60.2 R61.2 R81.1 R85.1 R86.1 R88.1 R91.1 R93.1 R94.1 R104.1 S1.3(P) S1.4(P1) TR1.2(S) TR2.3(D) TR4.3(D) TR5.2(S) TR7.2(S) TR8.3(D) TR9.2(S) U1.8(GND1) U1.44(GND2) U1.61(GND3) U1.85(TEST) U1.95(GND4) U1.104(JTAGSEL) U1.115(GND5) U1.135(GND6) U1.138(GND7) U2.2(GND) U2.4(GND) U3.2(NC2) U3.6(GND) U3.7(NC7) U3.9(SGND) U3.13(NC13) U3.14(NC14) U3.15(NC15) U3.16(NC16) U3.EXP(PAD) U4.9(GND) U5.17(GND) U5.21(CLK) U5.39(GND) U5.43(TST_MODE) U5.44(GND) U6.17(GND) U6.21(CLK) U6.39(GND) U6.43(TST_MODE) U6.44(GND) U7.17(GND) U7.21(CLK) U7.39(GND) U7.43(TST_MODE) U7.44(GND) U8.17(GND) U8.21(CLK) U8.39(GND) U8.43(TST_MODE) U8.44(GND) U9.17(GND) U9.21(CLK) U9.39(GND) U9.43(TST_MODE) U9.44(GND) U10.1(A:OE) U10.4(B:OE) U10.7(P:GND) U10.10(C:OE) U10.12(D:I) U10.13(D:OE) U11.7(P:GND) U13.7(P:GND) X2.2(GND) X2.4(GND)
GPIO2: J16.9 J39.7 U4.11(GPIO2)
GPIO5: J16.13 J39.2 U4.13(GPIO5)
GPIO16: J16.8 J39.6 U4.4(GPIO16)
HEATER0: TP6.TP U1.23(PA19/PGMD7/PWML0) U11.5(B:I0)
HEATER1: TP7.TP U1.22(PA20/PMGD8/PWML1) U11.8(C:I0)
HEATER2: TP8.TP U1.45(PA16/PGMD4/PWML2) U11.11(D:I0)
HEATER3: J1.8 U1.40(PC3/PWML3)
HEATER4: J1.13 U1.58(PC5/TIOA6)
HEATER5: J1.18 U1.82(PC8/TIOA7)
HEATER6: J1.23 U1.94(PC11/TIOA8)
HEATER7: J1.31 U1.49(PA15/PGMD3/TIOA1)
LCD_DB4: P2.10 U1.63(PD21)
LCD_DB5: P2.9 U1.65(PD20)
LCD_DB6: P2.7 U1.67(PD19)
LCD_DB7: P2.5 U1.69(PD18)
LCD_E: P2.8 U1.59(PA25/PGMD13)
LCD_RS: P2.6 U1.76(PC28)
MCCDA: R48.1 U1.112(PA28/MCCDA)
MCCK: R68.1 U1.129(PA29/MCCK)
MCDA0: R77.1 U1.116(PA30/MCDA0)
MCDA1: R78.1 U1.118(PA31/MCDA0)
MCDA2: R22.1 U1.62(PA26/PGMD14/MCDA2)
MCDA3: R25.1 U1.70(PA27/PGMD15/MCDA3)
MISO: R101.1 U1.68(PA12/PGMD0/MISO)
MISO_ESP: J16.4 R101.2 U4.6(GPIO12)
MOSI: R105.1 U1.42(PA13/PGMD1/MOSI)
MOSI_ESP: J16.5 R105.2 U4.7(GPIO13)
N$1: C24.2 U5.35(VHS)
N$2: C26.1 U5.13(5VOUT)
N$5: U13.3(A:O) U13.10(C:I1)
N$6: U13.6(B:O) U13.12(D:I0)
N$7: C14.1 R26.2 U5.12(SRA)
N$8: U13.8(C:O) U13.13(D:I1)
N$9: D9.A R69.1
N$10: JP9.2 U3.10(DIS)
N$11: C6.1 C12.+ C125.1 L2.2 L4.2 R84.2 R92.1
N$12: C1.1 C3.+ D1.C L2.1 R15.2
N$13: C5.1 U3.4(SS)
N$14: R84.1 U3.3(TON)
N$15: C96.1 U3.11(BOOT)
N$16: L4.1 R92.2 U3.1(VIN)
N$17: R26.1 R34.2 U5.9(BRA)
N$18: C96.2 D2.C L1.1 U3.12(LX)
N$19: D14.C JP10.2
N$20: C81.1 C97.1 C98.1 L1.2 L3.2 R87.2
N$21: R27.1 R32.2 U5.25(BRB)
N$22: C28.1 R27.2 U5.22(SRB)
N$23: D2.A R85.2 R86.2 U3.8(ISEN)
N$24: C81.2 R87.1 R88.2 U3.5(FB)
N$25: D3.C R1.1
N$26: R14.2 TR7.1(G)
N$27: C13.1 J22.MT1(SHIELD) J22.MT2(SHIELD) J22.P$1(SHIELD) J22.P$2(SHIELD)
N$28: J22.D- R3.2
N$29: J22.D+ R2.2
N$30: D15.C R55.1
N$31: D17.C R61.1
N$32: D16.C R60.1
N$33: J15.1(DAT2) R22.2 R73.1
N$34: J15.2(DAT3) R25.2 R74.1
N$35: J15.3(CMD) R48.2 R63.1
N$36: J15.5(CLK) R68.2
N$37: J15.7(DAT0/D0) R75.1 R77.2
N$38: J15.8(DAT1) R76.1 R78.2
N$39: J15.9(CARD_DETECT) R64.1 R79.2
N$40: R4.2 R5.1 U4.1(RESET)
N$41: IC1.5(A:Q) R82.2 U4.14(GPIO4)
N$42: R38.1 R46.2 U7.9(BRA)
N$43: R39.1 R44.2 U7.25(BRB)
N$44: C56.1 R39.2 U7.22(SRB)
N$45: C34.2 U7.35(VHS)
N$46: C36.1 U7.13(5VOUT)
N$49: C38.1 R38.2 U7.12(SRA)
N$50: R28.1 R35.2 U6.9(BRA)
N$51: R29.1 R33.2 U6.25(BRB)
N$52: C29.1 R29.2 U6.22(SRB)
N$53: C25.2 U6.35(VHS)
N$54: C27.1 U6.13(5VOUT)
N$57: C15.1 R28.2 U6.12(SRA)
N$58: R40.1 R47.2 U8.9(BRA)
N$59: R41.1 R45.2 U8.25(BRB)
N$60: C57.1 R41.2 U8.22(SRB)
N$61: C35.2 U8.35(VHS)
N$62: C37.1 U8.13(5VOUT)
N$65: C39.1 R40.2 U8.12(SRA)
N$66: R89.1 R94.2 U9.9(BRA)
N$67: R90.1 R93.2 U9.25(BRB)
N$68: C110.1 R90.2 U9.22(SRB)
N$69: C103.2 U9.35(VHS)
N$70: C104.1 U9.13(5VOUT)
N$73: C105.1 R89.2 U9.12(SRA)
N$74: D12.A R72.1
N$75: D10.A R70.1
N$76: D11.A R71.1
N$77: D19.A R96.1
N$78: R42.2 TR5.1(G)
N$79: R43.2 TR9.1(G)
N$80: R66.2 TR1.1(G)
N$81: R20.2 TR2.1(G)
N$82: D5.C D6.A R65.1
N$83: R23.2 TR4.1(G)
N$84: D7.A R67.1
N$85: R97.2 TR8.1(G)
N$86: D20.A R98.1
N$87: U11.1(A:O) U11.6(B:I1) U11.9(C:I1) U11.12(D:I1)
N$88: F2.2 J3.3
N$89: C65.1 R6.2 U1.12(PC27/AFE0_AD13)
N$90: C10.1 C52.1 C61.1 C62.1 C68.1 C69.1 C70.1 C71.1 C72.1 L6.1 U1.3(VDDOUT) U1.29(VDDCORE1) U1.33(VDDCORE2) U1.50(VDDCORE3) U1.81(VDDCORE4) U1.107(VDDCORE5) U1.123(VDDCORE6)
N$91: C63.1 R7.2 U1.14(PC31/AFE0_AD11)
N$92: C60.1 R8.2 U1.15(PC30/AFE0_AD10)
N$93: C59.1 R9.2 U1.16(PC29/AFE0_AD9)
N$94: C53.1 R10.2 U1.17(PC12//AFE0_AD8)
N$95: C18.1 R11.2 U1.18(PC15/AFE0_AD7)
N$96: C19.1 R12.2 U1.19(PC13/AFE0_AD6)
N$97: C84.1 R50.2 U1.24(PA18/PGMD6/AFE0_AD1)
N$98: C45.1 U1.142(PB9/XOUT) X2.1(C1)
N$99: C44.1 U1.141(PB8/XIN) X2.3(C2)
N$100: C66.1 R13.1
N$101: C67.1 L6.2 R13.2 U1.139(VDDPLL)
N$102: C2.1 D25.C R107.2 S1.1(S) S1.2(S1)
N$103: D4.C R104.2
NPCS0: IC1.1(A:CLR) R99.2 U1.64(PA11/PGMM3/NPCS0)
NPCS0_CONN: J16.11 R99.1 U4.10(GPIO15)
PB4/TDI: J21.8(NC/TDI) R36.1 U1.105(PB4/TDI)
PB6/TMS: J1.29 J21.2(SWDIO/TMS) R52.1 U1.79(PB6/TMS)
PB7/TCK: J21.4(SWDCLK/TCK) R49.1 R83.1 U1.89(PB7/TCK)
PS_ON: R14.1 R54.2 U1.106(PD15)
PS_ON_IN: J20.2 TR7.3(D)
PWR_FAIL_DET1: C80.1 R15.1 R16.2 U1.31(PB3/AFE1_AD1)
PWR_FAIL_DET2: C79.1 R80.1 R81.2 U1.41(PC4/AFE1_AD7)
RESET: D25.A J21.10(!RESET) R106.1 U1.83(NRST)
RESET_EXT: J1.44 R107.1
SAM_TFR_RDY: IC1.3(A:CLK) R82.1 U1.34(PD30)
SCK_ESP: J16.3
SD_CD: R79.1 U1.122(PC21)
SG_TST: J21.6(SWO/TDO) U1.109(PB5/TDO)
SG_TST_E0: U8.38(SG_TST) U13.9(C:I0)
SG_TST_E1: U9.38(SG_TST) U13.5(B:I1)
SG_TST_X: U5.38(SG_TST) U13.1(A:I0)
SG_TST_Y: U7.38(SG_TST) U13.2(A:I1)
SG_TST_Z: U6.38(SG_TST) U13.4(B:I0)
SPCK: R100.1 U1.51(PA14/PGMD2/SPCK)
SPCK_ESP: R100.2 U4.5(GPIO14)
SPI0_CS0: P1.3 U1.130(PC24/TIOB3)
SPI0_CS1: J37.3 U1.26(PB2/CTS0)
SPI0_CS2: J37.1 U1.111(PC18)
SPI0_MISO: J1.49 J37.6 P1.6 U1.21(PB0/RXD0)
SPI0_MOSI: J1.48 J37.5 P1.5 U1.20(PB1/TXD0)
SPI0_SCK: J1.47 J37.4 P1.4 U1.144(PB13/SCK0/DAC0)
SPI1_MISO: J1.34 U1.32(PA21/PGMD9/RXD1) U5.14(SDO) U6.14(SDO) U7.14(SDO) U8.14(SDO) U9.14(SDO)
SPI1_MOSI: U1.37(PA22/PGMD10/TXD1) U10.9(C:I)
SPI1_MOSI_BUF: J1.33 U5.15(SDI) U6.15(SDI) U7.15(SDI) U8.15(SDI) U9.15(SDI) U10.8(C:O)
SPI1_SCK: U1.46(PA23/PGMD11/SCK1) U10.2(A:I)
SPI1_SCK_BUF: R30.1 TP15.TP U5.16(SCK) U6.16(SCK) U7.16(SCK) U8.16(SCK) U9.16(SCK)
SPI1_SCK_BUF_EXP: J1.32 R30.2 U10.3(A:O)
THERMISTOR0: J5.1 R12.1 R21.1
THERMISTOR1: J12.1 R11.1 R19.1
THERMISTOR2: J14.1 R10.1 R53.1
THERMISTOR3: J1.35 R9.1
THERMISTOR4: J1.36 R8.1
THERMISTOR5: J1.37 R7.1
THERMISTOR6: J1.38 R6.1
THERMISTOR7: J1.39 R50.1
TWCK0: J1.46 U1.77(PA4/PGMNCMD/TWCK0)
TWD0: J1.45 U1.91(PA3/TWD0)
URXD0: J30.3 P1.9 U1.75(PA9/PGMM1)
URXD1: R102.2 U1.73(PA5/PGMRDY/URXD1)
URXD1_CONN: J16.15 J39.3 R102.1 U4.16(TXD)
USB_PWR_MON: C82.1 R31.2 R37.1 U1.124(PC22)
UTXD0: J30.4 P1.10 U1.66(PA10/PGMM2/UTXD0)
UTXD1: R103.2 U1.114(PA6/PGMNOE/UTXD1)
UTXD1_CONN: C83.1 J16.14 J39.5 R103.1 U4.15(RXD)
V_BED: C91.1 F4.2 R65.2 U$1.2
V_FAN: D8.C D18.C D21.C J2.2 J3.2 J24.2 J25.2 J29.2 J31.2
V_FUSED: C22.+ C23.+ C24.1 C25.1 C32.+ C33.+ C34.1 C35.1 C75.1 C76.1 C77.1 C78.1 C94.1 C101.1 C102.+ C103.1 D1.A F3.2 J11.1 J13.1 R67.2 R80.2 R98.2 U5.1(NC1) U5.4(VSA) U5.30(VSB) U5.33(NC33) U5.36(VS) U6.1(NC1) U6.4(VSA) U6.30(VSB) U6.33(NC33) U6.36(VS) U7.1(NC1) U7.4(VSA) U7.30(VSB) U7.33(NC33) U7.36(VS) U8.1(NC1) U8.4(VSA) U8.30(VSB) U8.33(NC33) U8.36(VS) U9.1(NC1) U9.4(VSA) U9.30(VSB) U9.33(NC33) U9.36(VS)
V_IN: D15.A F2.1 F3.1 F4.1 J23.1
VBUS: D3.A D13.A J22.VBUS R37.2
VSSA: F1.2 J1.40 J5.2 J12.2 J14.2 R83.2
X_DIR: TP3.2(TP1) U1.98(PD11) U5.41(DIR)
X_EN: TP3.3(TP2) U1.84(PD14) U5.18(!CS)
X_MOT_1A: C88.1 J9.2 U5.5(OA2) U5.10(OA2)
X_MOT_1B: C85.1 J9.1 U5.2(OA1) U5.7(OA1)
X_MOT_2A: C107.1 J9.3 U5.26(OB1) U5.31(OB1)
X_MOT_2B: C113.1 J9.4 U5.23(OB2) U5.28(OB2)
X_STEP: TP3.1(TP) U1.121(PD6) U5.42(STEP)
X_STOP: C40.1 D23.1(A1) R56.2 U1.97(PC14)
X_STOP_CON: J33.1
X_STOP_CONN: D12.C R56.1
Y_DIR: TP2.2(TP1) U1.92(PD12) U7.41(DIR)
Y_EN: TP2.3(TP2) U1.86(PC9) U7.18(!CS)
Y_MOT_1A: C89.1 J8.2 U7.5(OA2) U7.10(OA2)
Y_MOT_1B: C86.1 J8.1 U7.2(OA1) U7.7(OA1)
Y_MOT_2A: C108.1 J8.3 U7.26(OB1) U7.31(OB1)
Y_MOT_2B: C114.1 J8.4 U7.23(OB2) U7.28(OB2)
Y_STEP: TP2.1(TP) U1.119(PD7) U7.42(STEP)
Y_STOP: C41.1 D22.1(A1) R57.2 U1.93(PA2)
Y_STOP_CON: J32.1
Y_STOP_CONN: D9.C R57.1
Z_DIR: TP1.2(TP1) U1.88(PD13) U6.41(DIR)
Z_EN: TP1.3(TP2) U1.90(PC10) U6.18(!CS)
Z_MOT_1A: C106.1 J7.2 J36.2 U6.5(OA2) U6.10(OA2)
Z_MOT_1B: C87.1 J7.1 J36.1 U6.2(OA1) U6.7(OA1)
Z_MOT_2A: C109.1 J7.3 J36.3 U6.26(OB1) U6.31(OB1)
Z_MOT_2B: C115.1 J7.4 J36.4 U6.23(OB2) U6.28(OB2)
Z_PROBE_IN: J28.1 R62.1
Z_PROBE_MCU: C90.1 D24.2(A2) R62.2 U1.38(PC1/AFE1_AD4)
Z_PROBE_MOD: J28.3 U1.39(PC2) U10.5(B:I)
Z_PROBE_MOD_BUF: D4.A U10.6(B:O)
Z_STEP: TP1.1(TP) U1.113(PD8) U6.42(STEP)
Z_STOP: C42.1 D22.2(A2) R58.2 U1.108(PD29)
Z_STOP_CON: J19.1
Z_STOP_CONN: D10.C R58.1
Unconnected: IC1.6(A:!Q) IC1.8(B:!Q) IC1.9(B:Q) J21.7(KEY) J22.ID J37.10 U5.37(TST_ANA) U6.37(TST_ANA) U7.37(TST_ANA) U8.37(TST_ANA) U9.37(TST_ANA) U10.11(D:O) U13.11(D:O)

## Notes on the sheet
- F2 = 1A (optionally 2A)
- F3 = 7.5A (optionally 10A)
- F4 = 15A

## Library data of the parts
C1 C2 C4-C11 C13-C21 C24-C31 C34-C91 C94 C96-C98 C100 C101 C103-C111 C113-C125 = resistor:C-EU: CAPACITOR, European symbol
C3 C12 C22 C23 C32 C33 C99 C102 = resistor:CPOL-US: POLARIZED CAPACITOR, American symbol
D1 D2 D5 D8 D18 D21 D25 = diode:DIODE-: DIODE
D3 D4 D6 D7 D9-D12 D15-D17 D19 D20 = led:LED: LED OSRAM: - CHIPLED LG R971, LG N971, LY N971, LG Q971, LY Q971, LO R971, LY R971 LH N974, LH R974 LS Q976, LO Q976, LY Q976 LO Q996 - Hyper CHIPLED LW Q18S LB Q993, LB Q99A, LB R99A - SideLED LS A670, LO A670, LY A670, LG A670, LP A670 LB A673, LV A673, LT A673, LW A673 LH A674 LY A675 LS A676, LA A676, LO A676, LY A676, LW A676 LS A679, LY A679, LG A679 - Hyper Micro SIDELED® LS Y876, LA Y876, LO Y876, LY Y876 LT Y87S - SmartLED LW L88C, LW L88S LB L89C, LB L89S, LG L890 LS L89K, LO L89K, LY L89K LS L896, LA L896, LO L896, LY L896 - TOPLED LS T670, LO T670, LY T670, LG T670, LP T670 LSG T670, LSP T670, LSY T670, LOP T670, LYG T670 LG T671, LOG T671, LSG T671 LB T673, LV T673, LT T673, LW T673 LH T674 LS T676, LA T676, LO T676, LY T676, LB T676, LH T676, LSB T676, LW T676 LB T67C, LV T67C, LT T67C, LS T67K, LO T67K, LY T67K, LW E67C LS E67B, LA E67B, LO E67B, LY E67B, LB E67C, LV E67C, LT E67C LW T67C LS T679, LY T679, LG T679 LS T770, LO T770, LY T770, LG T770, LP T770 LB T773, LV T773, LT T773, LW T773 LH T774 LS E675, LA E675, LY E675, LS T675 LS T776, LA T776, LO T776, LY T776, LB T776 LHGB T686 LT T68C, LB T68C - Hyper Mini TOPLED® LB M676 - Mini TOPLED Santana® LG M470 LS M47K, LO M47K, LY M47K Source: http://www.osram.convergy.de LUXEON: - LUMILED® LXK2-PW12-R00, LXK2-PW12-S00, LXK2-PW14-U00, LXK2-PW14-V00 LXK2-PM12-R00, LXK2-PM12-S00, LXK2-PM14-U00 LXK2-PE12-Q00, LXK2-PE12-R00, LXK2-PE12-S00, LXK2-PE14-T00, LXK2-PE14-U00 LXK2-PB12-K00, LXK2-PB12-L00, LXK2-PB12-M00, LXK2-PB14-N00, LXK2-PB14-P00, LXK2-PB14-Q00 LXK2-PR12-L00, LXK2-PR12-M00, LXK2-PR14-Q00, LXK2-PR14-R00 LXK2-PD12-Q00, LXK2-PD12-R00, LXK2-PD12-S00 LXK2-PH12-R00, LXK2-PH12-S00 LXK2-PL12-P00, LXK2-PL12-Q00, LXK2-PL12-R00 Source: www.luxeon.com KINGBRIGHT: KA-3528ASYC Source: www.kingbright.com
D13 D14 = diode:S1M
D22-D24 = diode:BAT54C: Schottky Diodes Source: Fairchild .. BAT54.pdf
F1 = SparkFun-Fuses:PPTC: Resettable Fuse PPTC Resettable Fuse. Really a sort of resistor with a polymeric positive temperature coefficient whose resistance increases dramatically with an increase in temperature. When heated by the power passing through the resistance rises causing the current to be limited, protecting the circuit. This is achieved by the transition of the polymer from a crystalline to an amorphous state where the conductive carbon separates breaking the conductive pathways found in the cool crystalline structure. When a PPTC cools back down it resumes conducting letting the circuit turn back on. SparkFun Products: SparkFun RedBoard - Programmed with Arduino <https://www.sparkfun.com/products/12757> Pro Micro - 5V/16MHz <https://www.sparkfun.com/products/12640> Arduino Pro 328 - 5V/16MHz <https://www.sparkfun.com/products/10915> MP3 Trigger <https://www.sparkfun.com/products/13720>; PROD_ID: RES-08585; VALUE: 6V/0.5A
F2-F4 = fuse:FUSE: Fuse; OC_FARNELL: unknown; OC_NEWARK: unknown
IC1 = 74xx-us:74*74: Dual D type positive edge triggered FLIP FLOP, preset and clear
J1 = con-panduit:057-050-: CONNECTOR 50-pin series 057 contact pc board low profile headers; OC_FARNELL: unknown; OC_NEWARK: unknown
J2 J5 J12 J14 J24 J25 J29 J31 = con-molex:KK-156-2: KK 156 HEADER Source: http://www.molex.com/pdm_docs/sd/026604100_sd.pdf; MF: MOLEX; OC_FARNELL: unknown; OC_NEWARK: unknown
J3 = SparkFun-Connectors:CONN_03: Multi connection point. Often used as Generic Header-pin footprint for 0.1 inch spaced/style header connections On any of the 0.1 inch spaced packages, you can populate with these: Break Away Headers - Straight <https://www.sparkfun.com/products/116> (PRT-00116) Break Away Male Headers - Right Angle <https://www.sparkfun.com/products/553> (PRT-00553) Female Headers <https://www.sparkfun.com/products/115> (PRT-00115) Break Away Headers - Machine Pin <https://www.sparkfun.com/products/117> (PRT-00117) Break Away Female Headers - Swiss Machine Pin <https://www.sparkfun.com/products/743> (PRT-00743) Stackable Header - 3 Pin (Female, 0.1") <https://www.sparkfun.com/products/13875> (PRT-13875) For SCREWTERMINALS and SPRING TERMINALS visit here: Screw Terimnals on SparkFun.com <https://www.sparkfun.com/search/results?term=Screw+Terminals> (5mm/3.5mm/2.54mm spacing) This device is also useful as a general connection point to wire up your design to another part of your project. Our various solder wires solder well into these plated through hole pads. Hook-Up Wire - Assortment (Stranded, 22 AWG) <https://www.sparkfun.com/products/11375> (PRT-11375) Hook-Up Wire - Assortment (Solid Core, 22 AWG) <https://www.sparkfun.com/products/11367> (PRT-11367) View the entire wire category on our website here <https://www.sparkfun.com/categories/141> Special notes: Molex polarized connector foot print use with SKU : PRT-08232 with associated crimp pins and housings.; PROD_ID: XXX-00000; VALUE: 455-1750-1-ND
J6-J10 J28 J30 J36 = con-molex:KK-156-4: KK 156 HEADER Source: http://www.molex.com/pdm_docs/sd/026604100_sd.pdf; MF: MOLEX; OC_FARNELL: unknown; OC_NEWARK: unknown
J11 J13 = con-other:2-PIN-350
J15 = con-other:USDHC
J16 = con-other:CONN_ALT_HEADER
J19 J20 J32-J35 = con-molex:KK-156-3: KK 156 HEADER Source: http://www.molex.com/pdm_docs/sd/026604100_sd.pdf; MF: MOLEX; OC_FARNELL: unknown; OC_NEWARK: unknown
J21 = SparkFun-Connectors:CORTEX_DEBUG: Cortex Debug Connector - 10 pin Supports JTAG debug, Serial Wire debug, and Serial Wire Viewer. PTH and SMD connector options available. General Connector Information <http://infocenter.arm.com/help/topic/com.arm.doc.faqs/attached/13634/cortex_debug_connectors.pdf> Products: PTH Connector <http://www.digikey.com/product-detail/en/cnc-tech/3220-10-0100-00/1175-1627-ND/3883661> -via Digi-Key SparkFun PSoc <https://www.sparkfun.com/products/13229> SparkFun T <https://www.sparkfun.com/products/13810>
J22 = SparkFun-Connectors:USB_MICRO-B: USB Type Micro-B Connector Male/female and PTH/SMT variants SparkFun Products: SparkFun microB USB Breakout <https://www.sparkfun.com/products/12035> SparkFun USB microB Plug Breakout <https://www.sparkfun.com/products/10031> SparkFun ESP8266 Thing <https://www.sparkfun.com/products/13231>; PROD_ID: CONN-09505; SF_ID: PRT-08533
J23 U$1 = con-other:2-PIN-635
J37 P1 P2 = con-panduit:057-010-: CONNECTOR 10-pin series 057 contact pc board low profile headers; OC_FARNELL: unknown; OC_NEWARK: unknown
J39 = SparkFun-Connectors:CONN_04X2: Multi connection point. Often used as Generic Header-pin footprint for 0.1 inch spaced/style header connections On any of the 0.1 inch spaced packages, you can populate with these: Break Away Headers - Straight <https://www.sparkfun.com/products/116> (PRT-00116) Break Away Male Headers - Right Angle <https://www.sparkfun.com/products/553> (PRT-00553) Female Headers <https://www.sparkfun.com/products/115> (PRT-00115) Break Away Headers - Machine Pin <https://www.sparkfun.com/products/117> (PRT-00117) Break Away Female Headers - Swiss Machine Pin <https://www.sparkfun.com/products/743> (PRT-00743)
JP1 JP9 JP10 = jumper:JP1Q: JUMPER
L1 L2 L5-L7 = resistor:L-US: INDUCTOR, American symbol
L3 L4 = resistor:L-EU: INDUCTOR, European symbol
R1-R107 = resistor:R-US_: RESISTOR, American symbol
S1 = switch-omron:10-XX: OMRON SWITCH; MPN: B3F-1000; OC_FARNELL: 176432; OC_NEWARK: 36M3542
TP1-TP5 = misc:TP-3PIN
TP6-TP16 = misc:TP-VIA
TR1 TR5 TR7 TR9 = adafruit:MOSFET-N: N-Channel Mosfet 2N7002E - 60V 260mA SOT23 [Digikey: 2N7002ET1GOSTR-ND] - REEL BSH103 - 30V 850mA SOT23 [Digikey: 568-5013-1-ND]
TR2 TR4 TR8 = transistor-fet:SPD30P06P: SIPMOS(R) Power-Transistor P-Channel, Enhancement mode Source: http://www.infineon.com/upload/Document/cmc_upload/documents/012/3615/SPD_U30P06P.pdf
U1 = Arduino-DUE-V03:ATSAM4E8E
U2 = linear:UA78M*: POSITIVE-VOLTAGE REGULATORS Source: http://focus.ti.com/lit/ds/symlink/ua78m33.pdf
U3 = misc:A4403
U4 = adafruit:ESP-12
U5-U9 = TMC2660-Eval_v30:TMC2660
U10 = 74xx-eu:74*125: Quad bus BUFFER, 3-state
U11 = 74xx-us:74*02: Quad 2-input NOR gate
U13 = 74xx-eu:74*32: Quad 2-input OR gate
X2 = Arduino-DUE-V03:CRYSTAL-3.2-2.5